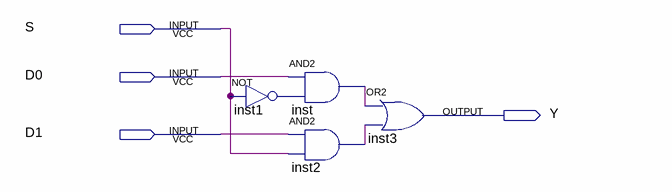
[diagram p0: schematic sheet]
// Quartus schematic mux2to1.bdf as structural Verilog: 4 symbols, 4 pins
module mux2to1 (
  input  S,
  input  D0,
  input  D1,
  output Y
);

  wire inst1_out, inst2_out, inst_out;

  not inst1 (inst1_out, S);
  and inst (inst_out, D0, inst1_out);
  and inst2 (inst2_out, D1, S);
  or inst3 (Y, inst_out, inst2_out);
endmodule
